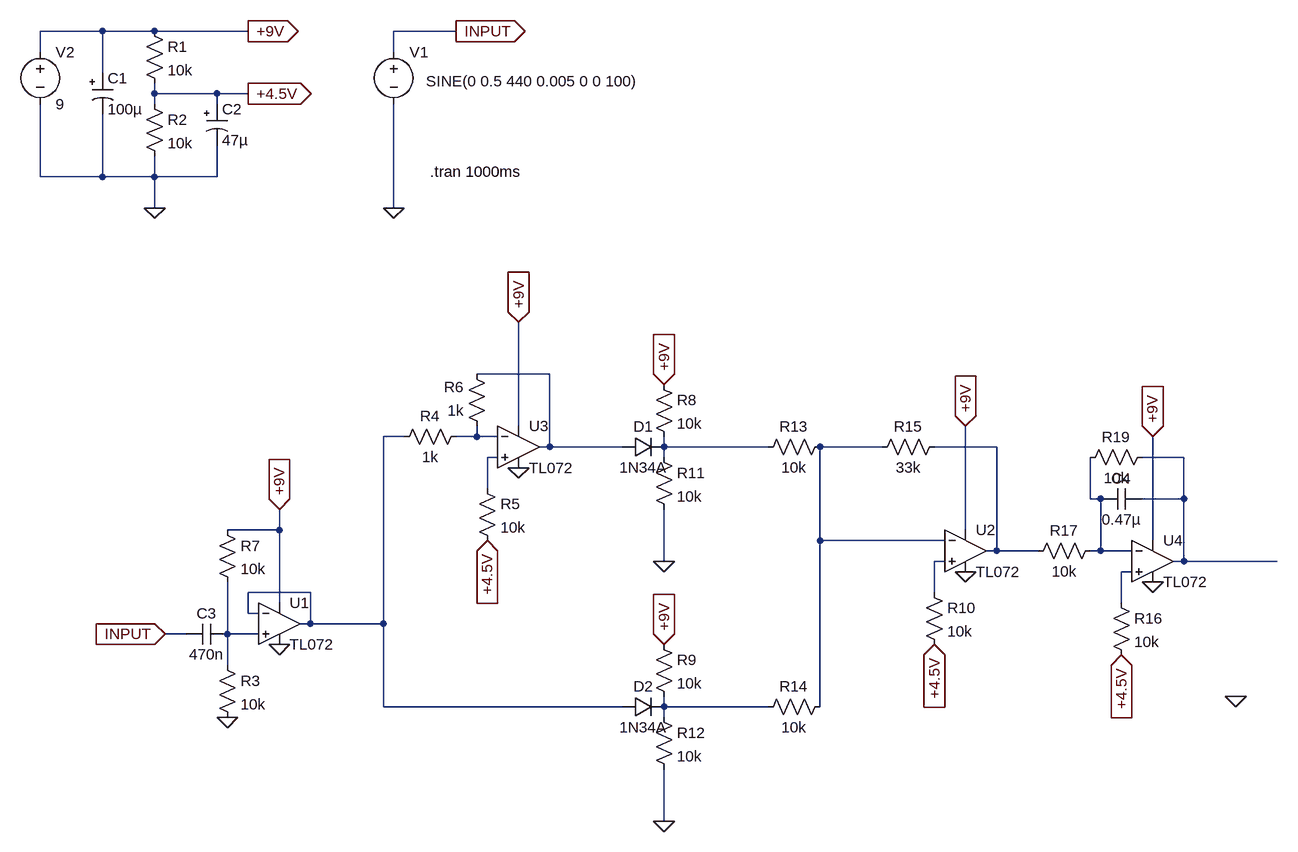
[diagram p0: schematic noise-gate.asc]
noise-gate.asc, the LTspice schematic file:
Version 4
SHEET 1 1604 1220
WIRE -304 -208 -400 -208
WIRE -224 -208 -304 -208
WIRE -80 -208 -224 -208
WIRE 240 -208 144 -208
WIRE -400 -176 -400 -208
WIRE 144 -176 144 -208
WIRE -304 -144 -304 -208
WIRE -224 -112 -224 -128
WIRE -128 -112 -224 -112
WIRE -80 -112 -128 -112
WIRE -224 -96 -224 -112
WIRE -128 -96 -128 -112
WIRE -400 16 -400 -96
WIRE -304 16 -304 -80
WIRE -304 16 -400 16
WIRE -224 16 -224 -16
WIRE -224 16 -304 16
WIRE -128 16 -128 -32
WIRE -128 16 -224 16
WIRE -224 64 -224 16
WIRE 144 64 144 -96
WIRE 384 320 272 320
WIRE 336 400 336 240
WIRE 160 416 128 416
WIRE 272 416 272 400
WIRE 272 416 240 416
WIRE 304 416 272 416
WIRE 384 432 384 320
WIRE 384 432 368 432
WIRE 496 432 384 432
WIRE 560 432 560 416
WIRE 720 432 560 432
WIRE 896 432 800 432
WIRE 1072 432 976 432
WIRE 304 448 288 448
WIRE 560 448 560 432
WIRE 1360 448 1296 448
WIRE 288 496 288 448
WIRE 1216 512 1216 448
WIRE 1232 512 1216 512
WIRE 1360 512 1360 448
WIRE 1360 512 1296 512
WIRE -32 560 -32 528
WIRE -32 560 -112 560
WIRE 1024 560 1024 400
WIRE 800 576 800 432
WIRE 992 576 800 576
WIRE 1312 576 1312 416
WIRE 1072 592 1072 432
WIRE 1072 592 1056 592
WIRE 1136 592 1072 592
WIRE 1232 592 1232 512
WIRE 1232 592 1216 592
WIRE 1280 592 1232 592
WIRE 560 608 560 528
WIRE 992 608 976 608
WIRE 1360 608 1360 512
WIRE 1360 608 1344 608
WIRE 1504 608 1360 608
WIRE 1280 624 1264 624
WIRE 16 656 -80 656
WIRE 976 656 976 608
WIRE -32 672 -32 560
WIRE 1264 672 1264 624
WIRE -80 688 -80 656
WIRE -64 688 -80 688
WIRE 16 704 16 656
WIRE 16 704 0 704
WIRE 128 704 128 416
WIRE 128 704 16 704
WIRE -176 720 -208 720
WIRE -112 720 -112 640
WIRE -64 720 -112 720
WIRE -112 768 -112 720
WIRE 128 832 128 704
WIRE 496 832 128 832
WIRE 560 832 560 816
WIRE 720 832 560 832
WIRE 800 832 800 576
WIRE 560 848 560 832
WIRE 560 1008 560 928
FLAG 144 64 0
FLAG -224 64 0
FLAG -80 -112 +4.5V
IOPIN -80 -112 Out
FLAG 240 -208 INPUT
IOPIN 240 -208 Out
FLAG -80 -208 +9V
IOPIN -80 -208 Out
FLAG -208 720 INPUT
IOPIN -208 720 In
FLAG -32 528 +9V
IOPIN -32 528 In
FLAG -32 736 0
FLAG 336 240 +9V
IOPIN 336 240 In
FLAG 288 576 +4.5V
IOPIN 288 576 In
FLAG 336 464 0
FLAG -112 848 0
FLAG 1024 400 +9V
IOPIN 1024 400 In
FLAG 976 736 +4.5V
IOPIN 976 736 In
FLAG 1024 624 0
FLAG 560 608 0
FLAG 560 336 +9V
IOPIN 560 336 In
FLAG 560 1008 0
FLAG 560 736 +9V
IOPIN 560 736 In
FLAG 1312 416 +9V
IOPIN 1312 416 In
FLAG 1264 752 +4.5V
IOPIN 1264 752 In
FLAG 1312 640 0
FLAG 1440 816 0
SYMBOL voltage 144 -192 R0
WINDOW 3 50 61 Left 2
SYMATTR Value SINE(0 0.5 440 0.005 0 0 100)
SYMATTR InstName V1
SYMBOL voltage -400 -192 R0
SYMATTR InstName V2
SYMATTR Value 9
SYMBOL res -240 -224 R0
SYMATTR InstName R1
SYMATTR Value 10k
SYMBOL res -240 -112 R0
SYMATTR InstName R2
SYMATTR Value 10k
SYMBOL polcap -320 -144 R0
SYMATTR InstName C1
SYMATTR Value 100µ
SYMBOL polcap -144 -96 R0
SYMATTR InstName C2
SYMATTR Value 47µ
SYMBOL cap -112 704 R90
WINDOW 0 0 32 VBottom 2
WINDOW 3 32 32 VTop 2
SYMATTR InstName C3
SYMATTR Value 470n
SYMBOL OpAmps/TL072 -32 640 R0
SYMATTR InstName U1
SYMBOL res 272 480 R0
SYMATTR InstName R5
SYMATTR Value 10k
SYMBOL OpAmps/TL072 336 368 R0
SYMATTR InstName U3
SYMBOL res 256 400 R90
WINDOW 0 0 56 VBottom 2
WINDOW 3 32 56 VTop 2
SYMATTR InstName R4
SYMATTR Value 1k
SYMBOL res 288 416 R180
WINDOW 0 36 76 Left 2
WINDOW 3 36 40 Left 2
SYMATTR InstName R6
SYMATTR Value 1k
SYMBOL res -128 752 R0
SYMATTR InstName R3
SYMATTR Value 10k
SYMBOL res -128 544 R0
SYMATTR InstName R7
SYMATTR Value 10k
SYMBOL res 960 640 R0
SYMATTR InstName R10
SYMATTR Value 10k
SYMBOL OpAmps/TL072 1024 528 R0
SYMATTR InstName U2
SYMBOL diode 496 448 R270
WINDOW 0 32 32 VTop 2
WINDOW 3 0 32 VBottom 2
SYMATTR InstName D1
SYMATTR Value 1N34A
SYMBOL res 544 320 R0
SYMATTR InstName R8
SYMATTR Value 10k
SYMBOL res 544 432 R0
SYMATTR InstName R11
SYMATTR Value 10k
SYMBOL diode 496 848 R270
WINDOW 0 32 32 VTop 2
WINDOW 3 0 32 VBottom 2
SYMATTR InstName D2
SYMATTR Value 1N34A
SYMBOL res 544 720 R0
SYMATTR InstName R9
SYMATTR Value 10k
SYMBOL res 544 832 R0
SYMATTR InstName R12
SYMATTR Value 10k
SYMBOL res 816 416 R90
WINDOW 0 0 56 VBottom 2
WINDOW 3 32 56 VTop 2
SYMATTR InstName R13
SYMATTR Value 10k
SYMBOL res 816 816 R90
WINDOW 0 0 56 VBottom 2
WINDOW 3 32 56 VTop 2
SYMATTR InstName R14
SYMATTR Value 10k
SYMBOL res 992 416 R90
WINDOW 0 0 56 VBottom 2
WINDOW 3 32 56 VTop 2
SYMATTR InstName R15
SYMATTR Value 33k
SYMBOL res 1248 656 R0
SYMATTR InstName R16
SYMATTR Value 10k
SYMBOL OpAmps/TL072 1312 544 R0
SYMATTR InstName U4
SYMBOL res 1232 576 R90
WINDOW 0 0 56 VBottom 2
WINDOW 3 32 56 VTop 2
SYMATTR InstName R17
SYMATTR Value 10k
SYMBOL cap 1296 496 R90
WINDOW 0 0 32 VBottom 2
WINDOW 3 32 32 VTop 2
SYMATTR InstName C4
SYMATTR Value 0.47µ
SYMBOL res 1312 432 R90
WINDOW 0 0 56 VBottom 2
WINDOW 3 32 56 VTop 2
SYMATTR InstName R19
SYMATTR Value 10k
TEXT 200 8 Left 2 !.tran 1000ms

The netlist it stands for:
* noise-gate.asc
V1 INPUT 0 SINE(0 0.5 440 0.005 0 0 100)
V2 +9V 0 9
R1 +9V +4.5V 10k
R2 +4.5V 0 10k
C1 +9V 0 100µ
C2 +4.5V 0 47µ
C3 N012 INPUT 470n
XU1 N012 N002 +9V 0 N002 TL072  ; pins In+ In- V+ V- OUT
R5 N007 +4.5V 10k
XU3 N007 N003 +9V 0 N001 TL072  ; pins In+ In- V+ V- OUT
R4 N003 N002 1k
R6 N003 N001 1k
R3 N012 0 10k
R7 +9V N012 10k
R10 N010 +4.5V 10k
XU2 N010 N005 +9V 0 N006 TL072  ; pins In+ In- V+ V- OUT
D1 N001 N004 1N34A
R8 +9V N004 10k
R11 N004 0 10k
D2 N002 N013 1N34A
R9 +9V N013 10k
R12 N013 0 10k
R13 N005 N004 10k
R14 N005 N013 10k
R15 N006 N005 33k
R16 N011 +4.5V 10k
XU4 N011 N009 +9V 0 N008 TL072  ; pins In+ In- V+ V- OUT
R17 N009 N006 10k
C4 N008 N009 0.47µ
R19 N008 N009 10k
.model D D
.lib standard.dio
.tran 1000ms
.backanno
.end